# EAGLE design okinesio_v02 (EAGLE 7.5.0)
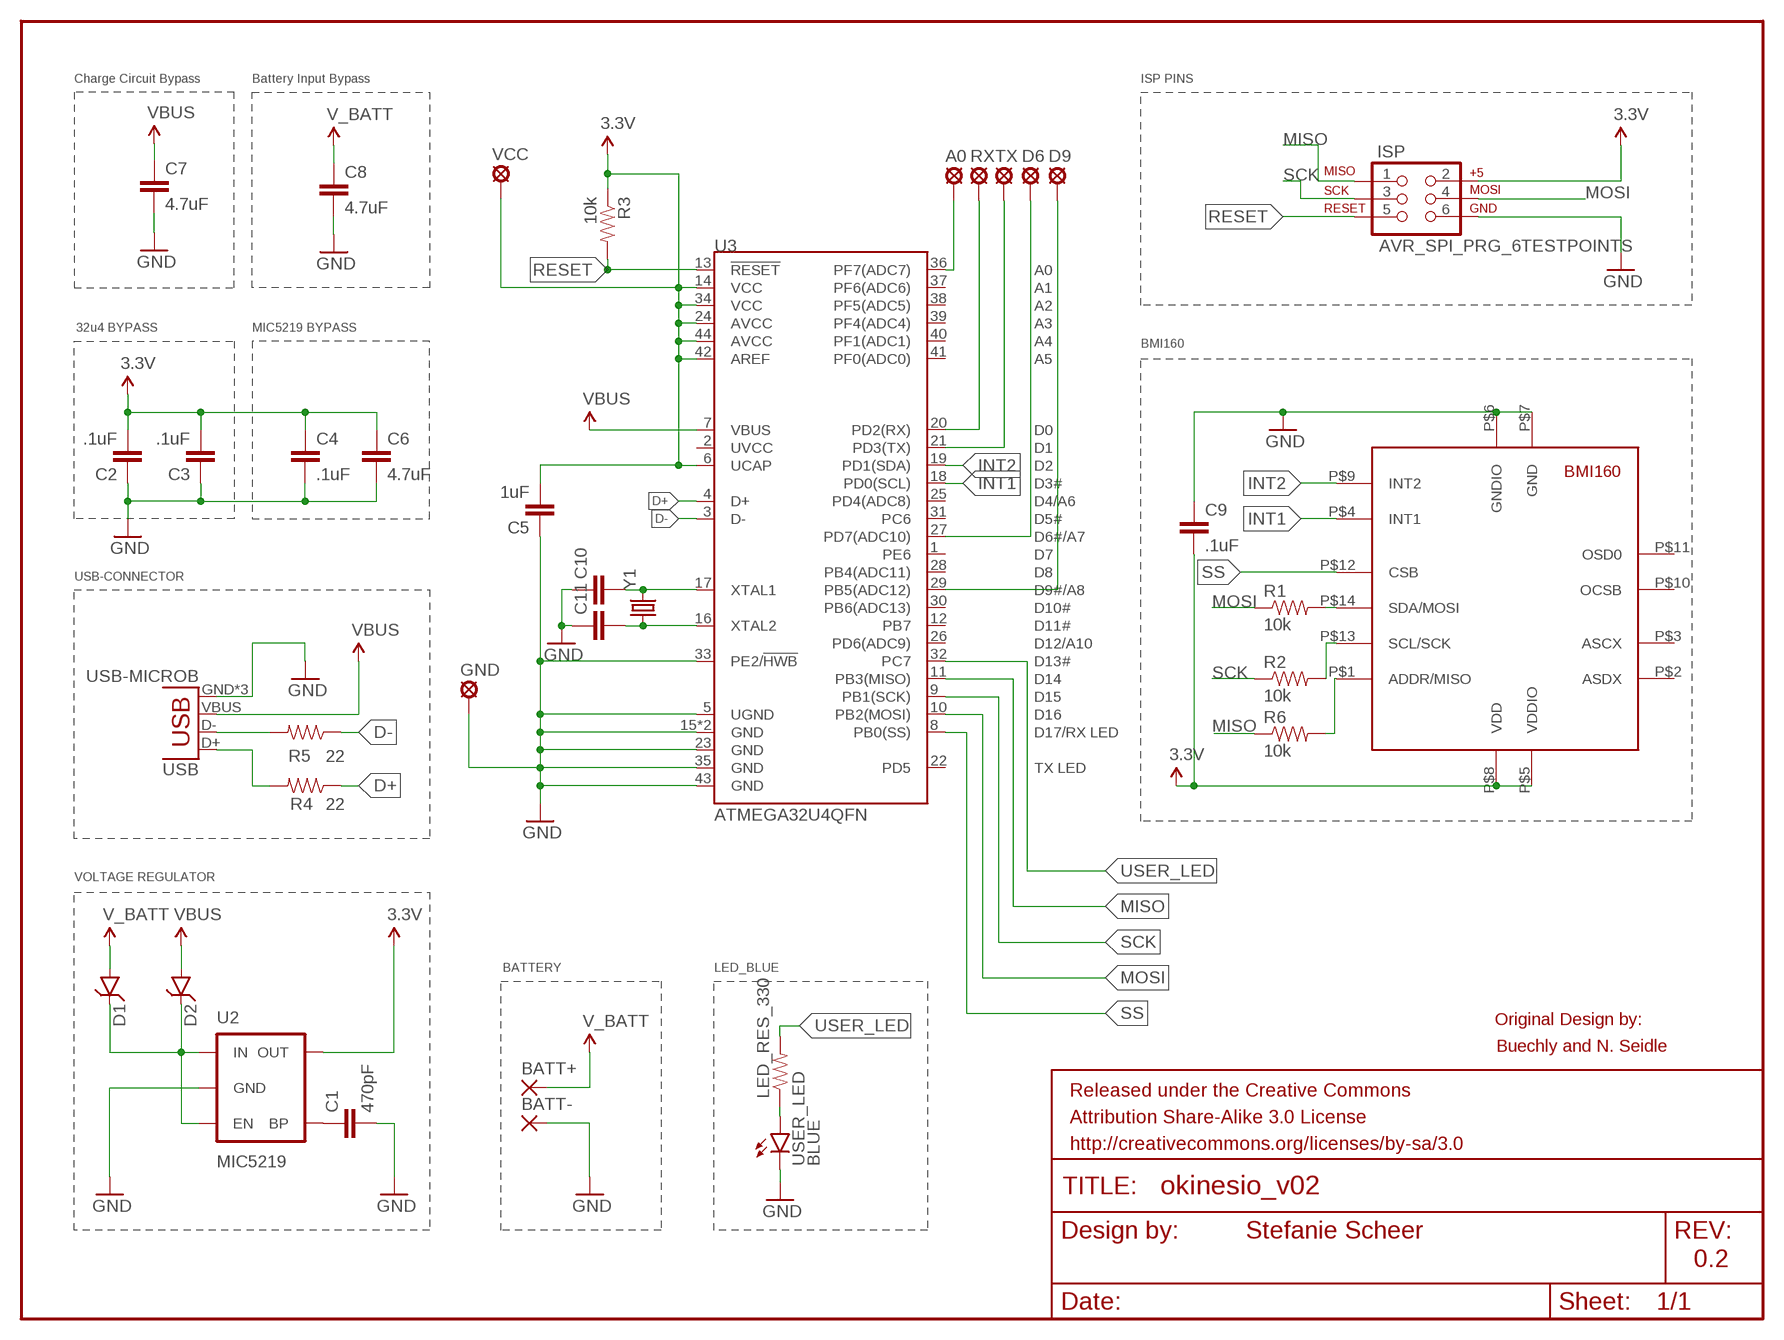
[diagram p0: schematic, sheet 1]

## Parts
A0  LSP10  [LSP10]
BATT+  SMD2  [SMD1,27-2,54]
BATT-  SMD2  [SMD1,27-2,54]
C1  470pF  CAP0603-CAP  [0603-CAP]
C2  .1uF  CAP0603-CAP  [0603-CAP]
C3  .1uF  CAP0603-CAP  [0603-CAP]
C4  .1uF  CAP0603-CAP  [0603-CAP]
C5  1uF  CAP0603-CAP  [0603-CAP]
C6  4.7uF  CAP0603-CAP  [0603-CAP]
C7  4.7uF  CAP0805  [0805]
C8  4.7uF  CAP0805  [0805]
C9  .1uF  CAP0603-CAP  [0603-CAP]
C10  CAP0603-CAP  [0603-CAP]
C11  CAP0603-CAP  [0603-CAP]
D1  DIODESOD123  [SOD-123]
D2  DIODESOD123  [SOD-123]
D6  LSP10  [LSP10]
D9  LSP10  [LSP10]
GND  LSP10  [LSP10]
ISP  AVR_SPI_PRG_6TESTPOINTS  [2X3_TEST_POINTS]
LED_RES_330  RESISTOR0603  [0603-RES]
R1  10k  RESISTOR0603-RES  [0603-RES]
R2  10k  RESISTOR0603-RES  [0603-RES]
R3  10k  RESISTOR0603-RES  [0603-RES]
R4  22  RESISTOR0603-RES  [0603-RES]
R5  22  RESISTOR0603-RES  [0603-RES]
R6  10k  RESISTOR0603-RES  [0603-RES]
RX  LSP10  [LSP10]
TX  LSP10  [LSP10]
U2  MIC5219  V_REG_MIC5219SMD  [SOT23-5]
U3  ATMEGA32U4QFN  [QFN-44]
U$3  BMI160LGA14  [LGA14-BMI160]
USB  USB-MICROB  [USB-MICROB]
USER_LED  BLUE  LED-BLUE0603  [LED-0603]
VCC  LSP10  [LSP10]
Y1  CRYSTALTXC-7A  [CRYSTAL-TXC-7A]

## Nets
3.3V: C2.2 C3.2 C4.1 C5.2 C6.1 C9.2 ISP.2 R3.1 U2.5(OUT) U3.6(UCAP) U3.14(VCC) U3.24(AVCC) U3.34(VCC) U3.42(AREF) U3.44(AVCC) U$3.P$5(VDDIO) U$3.P$8(VDD) VCC.MP
5V: C7.1 D2.A U3.7(VBUS) USB.VBUS ; supply symbol labelled VBUS
D+: R4.1 U3.4(D+)
D-: R5.1 U3.3(D-)
GND: BATT-.1(P) C1.2 C2.1 C3.1 C4.2 C5.1 C6.2 C7.2 C8.2 C9.1 C10.1 C11.1 GND.MP ISP.6 U2.2(GND) U3.5(UGND) U3.15(GND) U3.23(GND) U3.33(PE2/!HWB) U3.35(GND) U3.43(GND) U3.EPAD(GND) U$3.P$6(GNDIO) U$3.P$7(GND) USB.GND USB.MT1(GND) USB.MT2(GND) USER_LED.C
INT1: U3.18(PD0(SCL)) U$3.P$4(INT1)
INT2: U3.19(PD1(SDA)) U$3.P$9(INT2)
MISO: ISP.1 R6.1 U3.11(PB3(MISO))
MOSI: ISP.4 R1.1 U3.10(PB2(MOSI))
N$1: D1.C D2.C U2.1(IN) U2.3(EN)
N$2: D6.MP U3.27(PD7(ADC10))
N$3: TX.MP U3.21(PD3(TX))
N$4: A0.MP U3.36(PF7(ADC7))
N$5: C10.2 U3.17(XTAL1) Y1.P$2
N$6: D9.MP U3.29(PB5(ADC12))
N$7: LED_RES_330.1 USER_LED.A
N$8: C1.1 U2.4(BP)
N$9: RX.MP U3.20(PD2(RX))
N$12: R1.2 U$3.P$14(SDA/MOSI)
N$13: R5.2 USB.D-
N$14: R4.2 USB.D+
N$15: R2.2 U$3.P$13(SCL/SCK)
N$16: R6.2 U$3.P$1(ADDR/MISO)
N$18: C11.2 U3.16(XTAL2) Y1.P$1
RESET: ISP.5 R3.2 U3.13(!RESET)
SCK: ISP.3 R2.1 U3.9(PB1(SCK))
SS: U3.8(PB0(SS)) U$3.P$12(CSB)
USER_LED: LED_RES_330.2 U3.32(PC7)
V_BATT: BATT+.1(P) C8.1 D1.A
Unconnected: U3.1(PE6) U3.2(UVCC) U3.12(PB7) U3.22(PD5) U3.25(PD4(ADC8)) U3.26(PD6(ADC9)) U3.28(PB4(ADC11)) U3.30(PB6(ADC13)) U3.31(PC6) U3.37(PF6(ADC6)) U3.38(PF5(ADC5)) U3.39(PF4(ADC4)) U3.40(PF1(ADC1)) U3.41(PF0(ADC0)) U$3.P$2(ASDX) U$3.P$3(ASCX) U$3.P$10(OCSB) U$3.P$11(OSD0)

## Notes on the sheet
- Charge Circuit Bypass | Battery Input Bypass | ISP PINS
- 32u4 BYPASS | MIC5219 BYPASS
- BMI160
- USB-CONNECTOR
- VOLTAGE REGULATOR
- BATTERY | LED_BLUE
- Original Design by:
- Buechly and N. Seidle
- Stefanie Scheer
- 0.2

## Library data of the parts
A0 D6 D9 GND RX TX VCC = solpad:LSP10: SOLDER PAD drill 1.0 mm, distributor Buerklin, 12H555
BATT+ BATT- = wirepad_3x2:SMD2: SMD PAD
C1 = SparkFun-Passives:CAP: Capacitor Standard 0603 ceramic capacitor, and 0.1" leaded capacitor.; PROD_ID: CAP-07884
C2 C9 = SparkFun-Passives:CAP: Capacitor Standard 0603 ceramic capacitor, and 0.1" leaded capacitor.; PROD_ID: CAP-00810
C3 = SparkFun-Passives:CAP: Capacitor Standard 0603 ceramic capacitor, and 0.1" leaded capacitor.; PROD_ID: CAP-08280
C4 C6-C8 C10 C11 = SparkFun-Capacitors:CAP: Capacitor Standard 0603 ceramic capacitor, and 0.1" leaded capacitor.
C5 = SparkFun-Passives:CAP: Capacitor Standard 0603 ceramic capacitor, and 0.1" leaded capacitor.; PROD_ID: CAP-00868
D1 D2 = SparkFun-DiscreteSemi_angepasst:DIODE: Diode These are standard reverse protection diodes and small signal diodes. SMA package can handle up to about 1A. SOD-323 can handle about 200mA. What the SOD-323 package when ordering, there are some mfgs out there that are 5-pin packages.
ISP = SparkFun-Connectors_usb_neu_2:AVR_SPI_PRG_6: AVR ISP 6 Pin This is the reduced ISP connector for AVR programming. Common on Arduino. This footprint will take up less PCB space and can be used with a 10-pin to 6-pin adapter such as SKU: BOB-08508 **Special note about "TEST_POINT" package. The stop mask is on the top side, so if you want your programming test points to be on the bottom of your board, make sure to place this package on the bottom side of the board. This also ensure that the orientation to program from the bottom side will be correct.
LED_RES_330 = SparkFun-Resistors:RESISTOR: Resistor Basic schematic elements and footprints for 0603, 1206, and PTH resistors.
R1-R3 R6 = SparkFun-Passives:RESISTOR: Resistor Basic schematic elements and footprints for 0603, 1206, and PTH resistors.; PROD_ID: RES-00824
R4 R5 = SparkFun-Passives:RESISTOR: Resistor Basic schematic elements and footprints for 0603, 1206, and PTH resistors.; PROD_ID: RES-08698
U2 = SparkFun-PowerIC:V_REG_MIC5219: V_REG MIC5219 Standard 500mA LDO voltage regulator in SOT-23 layout. Micrel part MIC5219. BP (by-pass) pin is used to lower output noise with 470pF cap, may be left open.; PROD_ID: VREG-09872
U3 = SparkFun-DigitalIC:ATMEGA32U4: Atmel 44-pin 8-bit Microcontroller with 32KBytes of ISP Flash and USB Controller; PROD_ID: IC-10828
U$3 = User-Submitted:BMI160: BMI160 Internal Measurement Unit
USB = SparkFun-Connectors_usb_neu_2:USB: USB Connectors USB-B-PTH is fully proven SKU : PRT-00139/CONN-08278 USB-miniB is fully proven SKU : PRT-00587 USB-A-PCB is untested. USB-A-H is throughly reviewed, but untested. Spark Fun Electronics SKU : PRT-00437 USB-B-SMT is throughly reviewed, but untested. Needs silkscreen touching up. USB-A-S has not been used/tested USB-MB-H has not been used/tested USB-MICROB has been used. CONN-09505; PROD_ID: CONN-09505
USER_LED = SparkFun-LED:LED-BLUE: Blue LEDs for production use Various blue LEDs stocked by SparkFun production 0603 - DIO-08575 Rebel - DIO-09553 1206 - DIO-09911; PROD_ID: DIO-08575
Y1 = SparkFun-FreqCtrl:CRYSTAL: Various standard crystals. Proven footprints.

## Board
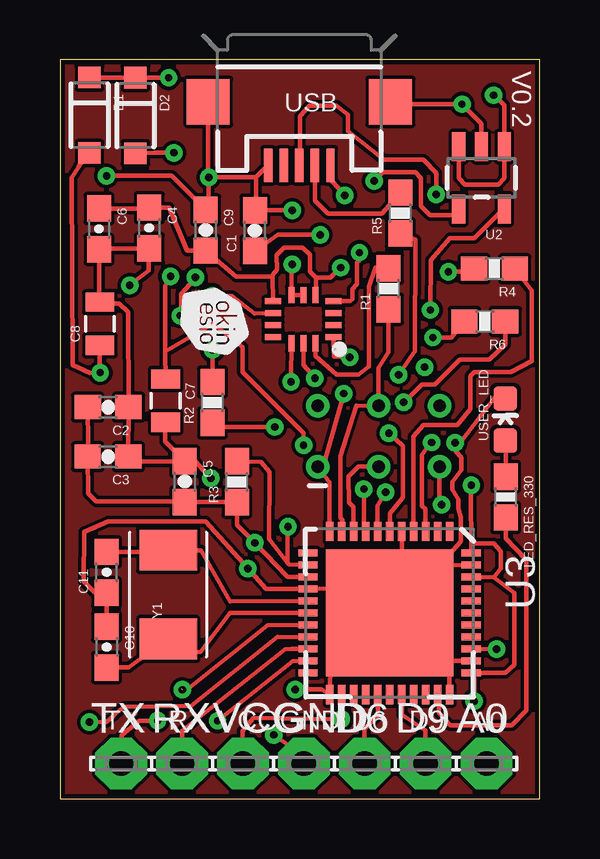
[diagram p1: board, top side]
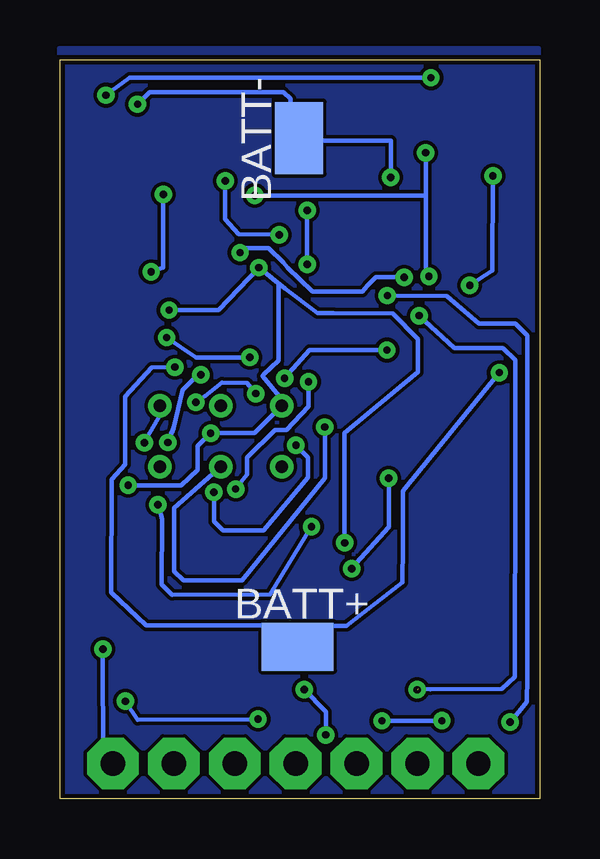
[diagram p2: board, bottom side, seen from below]

Size 20 x 30.8 mm. Coordinates in mm from the lower left corner, seen from the top.
Outline: 0,0 20,0 20,30.8 0,30.8 0,0
Copper layers (1*16): Top 0.035mm / dielectric 1.5mm / Bottom 0.035mm
Design rules "Eagle-DRU LochLP GmbH - 01 and 02 layers - 35mue *": minimum track width 0.15mm, minimum drill 0.3mm, track to track 0.15mm, track to pad 0.15mm, pad to pad 0.15mm, via to via 0.15mm, smd to smd 0.15mm, copper to edge 0.2mm, drill to drill 0.25mm, minimum pad ring 0.23mm, minimum via ring 0.21mm, stop-mask expansion 0.05mm, vias tented up to drill 12mil, thermal gap 0.2mm

### Footprints (pad centres in the part's own frame; a part is rotated, then mirrored left to right if it is on the bottom)
LSP10 = drill 1.016 pad 2.159 octagon: MP 0,0
SMD1,27-2,54 = smd 1.27 x 2.54: 1 0,0 | smd 2 x 3: P$1 0.362,0.235
0603-CAP = smd 1.1 x 1: 1 -0.85,0; 2 0.85,0
0805 = smd 0.8 x 1.2: 1 -0.9,0; 2 0.9,0
SOD-123 = smd 0.9 x 0.95: A 1.575,0; C -1.575,0
2X3_TEST_POINTS = drill 0.508: 1 -2.54,-1.27; 2 -2.54,1.27; 3 0,-1.27; 4 0,1.27; 5 2.54,-1.27; 6 2.54,1.27
0603-RES = smd 1.1 x 1: 1 -0.85,0; 2 0.85,0
SOT23-5 = smd 0.55 x 1.2: 1 -0.95,-1.3; 2 0,-1.3; 3 0.95,-1.3; 4 0.95,1.3; 5 -0.95,1.3
QFN-44 = smd 0.8 x 0.3: 1 -3.4,2.5; 2 -3.4,2; 3 -3.4,1.5; 4 -3.4,1; 5 -3.4,0.5; 6 -3.4,0; 7 -3.4,-0.5; 8 -3.4,-1; 9 -3.4,-1.5; 10 -3.4,-2; 11 -3.4,-2.5; 23 3.4,-2.5; 24 3.4,-2; 25 3.4,-1.5; 26 3.4,-1; 27 3.4,-0.5; 28 3.4,0; 29 3.4,0.5; 30 3.4,1; 31 3.4,1.5; 32 3.4,2; 33 3.4,2.5 | smd 0.3 x 0.8: 12 -2.5,-3.4; 13 -2,-3.4; 14 -1.5,-3.4; 15 -1,-3.4; 16 -0.5,-3.4; 17 0,-3.4; 18 0.5,-3.4; 19 1,-3.4; 20 1.5,-3.4; 21 2,-3.4; 22 2.5,-3.4; 34 2.5,3.4; 35 2,3.4; 36 1.5,3.4; 37 1,3.4; 38 0.5,3.4; 39 0,3.4; 40 -0.5,3.4; 41 -1,3.4; 42 -1.5,3.4; 43 -2,3.4; 44 -2.5,3.4 | smd 5.3 x 5.3: EPAD 0,0
LGA14-BMI160 = smd 0.675 x 0.25: P$1 -1.262,0.75; P$2 -1.262,0.25; P$3 -1.262,-0.25; P$4 -1.262,-0.75; P$8 1.262,-0.75; P$9 1.262,-0.25; P$10 1.262,0.25; P$11 1.262,0.75 | smd 0.25 x 0.675: P$5 -0.5,-1.012; P$6 0,-1.012; P$7 0.5,-1.012; P$12 0.5,1; P$13 0,1; P$14 -0.5,1
USB-MICROB = smd 0.35 x 1.4: D+ 0,2.65; D- -0.65,2.65; GND 1.3,2.65; ID 0.65,2.65; VBUS -1.3,2.65 | smd 1.8 x 1.9: MT1 -3.8,0; MT2 3.8,0
LED-0603 = smd 1 x 1: A 0,-0.877; C 0,0.877
CRYSTAL-TXC-7A = smd 1.7 x 2.4: P$1 1.85,0; P$2 -1.85,0

### Placement (x,y rotation side)
A0  17.79,1.47 0 top
BATT+  10.32,6.7 270 bottom
BATT-  10.38,27.3 0 bottom
C1  8.13,23.69 90 top
C2  2.01,16.32 180 top
C3  2.01,14.27 180 top
C4  3.73,23.79 270 top
C5  5.21,13.22 270 top
C6  1.63,23.75 270 top
C7  4.41,16.6 270 top
C8  1.67,19.8 90 top
C9  6.07,23.7 270 top
C10  1.95,6.32 270 top
C11  1.95,9.44 90 top
D1  1.23,28.49 270 top
D2  3.14,28.48 270 top
D6  12.71,1.47 0 top
D9  15.25,1.47 0 top
GND  10.17,1.47 0 top
ISP  13.29,15.11 0 top
LED_RES_330  18.59,12.58 270 top
R1  13.71,21.26 90 top
R2  6.35,16.52 90 top
R3  7.38,13.21 90 top
R4  18.12,22.1 180 top
R5  14.19,24.42 90 top
R6  17.72,19.9 180 top
RX  5.09,1.47 0 top
TX  2.55,1.47 0 top
U2  17.58,25.88 180 top
U3  13.75,7.74 270 top
U$3  10.15,19.99 180 top
USB  9.98,29.06 180 top
USER_LED  18.57,15.81 0 top
VCC  7.63,1.47 0 top
Y1  4.51,8.51 90 top

### Tracks (layer width: path | path; a pad name or v marks a point on that pad's centre or on a via)
3.3V  (via drill 0.3)
  Top 0.178: 18.08,9.23 18.38,9.6 18.38,10.3 18.1,10.65 17.18,10.65 U3.44 17.14,12.87 v17.16,13.07 | 18.08,9.23 U3.42 | 18.08,9.23 18.95,8.59 18.95,5.57 18.57,5.24 U3.34 17.27,5.03 v17.27,4.06 | U$3.P$8 8.86,21.77 | 10.67,21.73 10.67,21.02 U$3.P$5 | U2.5 18.49,24.58 17.27,23.37 16.26,23.37 15.47,22.46 v15.45,20.37 | v11.7,22.14 11.29,21.72 10.67,21.73 | 1.15,15.98 C2.2 1.17,14.79 C3.2 1.17,12.73 1.51,12.4 5.01,12.4 C5.2 R3.1 7.38,11.42 v8.13,10.67 9.47,9.28 | 8.86,21.77 7.34,21.77 C9.2 5.3,22.86 4.56,24.65 C4.1 3.61,24.61 C6.1 | 9.47,9.28 10.41,9.21 U3.14 9.51,9.26 9.47,9.28 | VCC.MP 7.62,2.84 8.08,3.37 v11.74,3.32 | v11.74,3.32 11.75,4.06 11.75,4.66 U3.24 11.77,4.14 v11.74,3.32 | U3.6 13.77,11.88 14.29,12.55 14.3,14.7 v13.72,15.24 | 8.86,21.77 8.86,21.82 9.05,22.06 9.03,22.66 9.34,22.98 10.12,22.98 10.42,22.68 10.42,21.97 10.67,21.73
  Bottom 0.178: v15.45,20.37 13.39,20.37 v11.7,22.14 | v11.7,22.14 10.89,21.47 10.88,18.27 11.52,17.69 11.56,17.63 10.75,16.66 ISP.2 11.89,15.24 v13.72,15.24 14.26,14.7 14.26,13.72 14.94,13.07 v17.16,13.07 | v11.74,3.32 16.77,3.29 v17.27,4.06 | v8.13,10.67 8.13,15.24 5.08,17.78 5.08,19.16 6.11,20.23 8.59,20.24 9.27,20.24 10.62,21.28 v11.7,22.14
5V  (via drill 0.3)
  Top 0.178: U3.7 13.25,12.21 v13.58,12.79 | D2.A 3.94,26.93 v4.75,26.93 | USB.VBUS 11.28,25.8 11.68,25.4 11.69,25.4 v11.87,25.15 | v4.62,21.78 4.38,21.37 4.38,20.37 4.39,20.36 4.38,18.6 C7.1 4.38,18.65 6.39,19.8 7.62,18.84 7.62,17.78 10.16,15.24 v10.16,14.73
  Bottom 0.178: v13.58,12.79 13.57,11.56 13.21,11.18 11.51,11.18 9.65,13.38 9.65,14.22 v10.16,14.73 | v11.87,25.15 9.45,25.14 4.75,25.15 | 4.75,25.15 v4.75,26.93 | 4.75,25.15 4.75,22.17 v4.62,21.78
D+
  Top 0.178: R4.1 19.67,21.19 19.68,20.71 19.68,20.48 19.68,18.24 18.8,17.78 17.27,17.78 17.11,17.62 17.11,17.34 17.11,16.26 16.57,15.57 15.16,15.57 14.73,15.09 14.73,11.57 U3.4
D-  (via drill 0.3 pad 0.25)
  Top 0.178: U3.3 15.23,11.57 15.24,11.58 15.24,12.07 15.09,12.21 15.09,14.34 15.39,14.74 v15.5,14.85 | v14.12,17.68 14.22,17.81 14.8,18.67 14.83,23.32 R5.1
  Bottom 0.178: v15.5,14.85 15.26,15.45 14.88,17.04 14.4,17.52 v14.12,17.68
GND  (via drill 0.3, 0.3 pad 0.25, 0.3 pad 0.3)
  Top 0.178: U3.5 14.28,9.82 | 14.28,9.82 14.28,8.09 U3.EPAD 13.77,6.14 11.28,6.14 11.28,5.25 U3.23 | 16.82,5.76 16.27,5.76 16.25,5.57 U3.33 | U3.35 13.84,5.75 | 13.73,8.8 U3.15 10.34,8.76 9.08,8.76 8.59,8.76 v7.84,9.59 6.08,11.55 2.01,11.55 1.01,11.12 0.99,9.07 1.46,8.61 C11.1 1.95,8.14 C10.1 | U3.43 16.23,9.74 | 14.28,9.82 16.25,10.19 16.72,10.73 16.72,11.72 16.61,12.11 16.61,12.48 16.36,12.89 16.36,13.21 16.74,13.72 16.74,14.22 16.48,14.51 v16.48,14.84 16.7,14.85 18.11,16.7 USER_LED.C | 11.27,4.68 U3.23 | 17.59,26.9 U2.2 17.57,28.14 v16.76,28.96 13.88,28.96 USB.MT1 | 6.17,29.04 USB.MT2 6.18,26 v6.2,25.91 | 8.69,26.34 8.69,26.4 USB.GND 8.19,25.91 | 8.19,25.91 v6.2,25.91 | 8.19,25.91 8.19,24.6 C1.2 9.12,24.53 v9.69,24.53 | v6.2,25.91 6.2,24.68 C9.1 4.65,25.97 v1.94,25.97 | 5.24,14.1 C5.1 | C5.1 3.15,14.07 C3.1 C2.1 2.85,20.29 2.47,20.65 1.72,20.65 C8.2 1.63,20.74 C6.2 1.67,22.94 C4.2 3.7,22.01 v2.91,21.41 | C5.1 5.66,14.07 v6.29,13.36 | GND.MP 10.18,1.79 v8.91,2.66 | v9.81,4.56 10.9,4.56 U3.23 | U$3.P$6 U$3.P$7 9.65,21.84 v9.69,22.28 | C7.2 4.38,14.89 C5.1
  Top 0.254: U3.35 16.82,5.76 | 13.73,8.8 U3.EPAD | 16.23,9.74 16.25,10.19 | 13.77,6.14 13.84,5.75
  Bottom 0.178: v6.2,25.91 6.21,27.43 10.26,27.43 BATT-.1 10.38,29.18 10.67,29.46 16.26,29.46 v16.76,28.96 | v6.29,13.36 6.27,11.34 v7.84,9.59 | ISP.6 15.83,16 v16.48,14.84 | v8.91,2.66 8.9,3.62 v9.81,4.56 | v9.69,22.28 v9.69,24.53 | v1.94,25.97 1.97,22.01 v2.91,21.41
INT1  (via drill 0.3)  (1 unrouted)
  Top 0.178: U$3.P$4 12.1,20.74 12.19,20.83 12.19,21.25 12.38,21.46 12.38,22.36 12.49,22.44 v12.49,22.77 | v5.64,21.74 5.59,21.65 5.04,21.03 5.04,20.43 v5.03,20.14 | v5.1,4.54 5.36,4.61 8.66,7.23 10.25,7.25 U3.18
  Bottom 0.178: 5.08,4.57 4.55,4.57 1.56,4.59 1.02,5.09 1.02,13.72 1.02,18.29 1.52,18.8 3.56,18.8 v5.03,20.14 | v12.49,22.77 12.46,22.77 12.28,22.95 11.31,22.95 10.67,22.35 10.52,22.15 9.46,21.14 8.79,21.14 8.15,21.14 7.38,21.14 7.17,21.38 6.83,21.75 6.35,21.75 5.66,21.75 v5.64,21.74
INT2  (via drill 0.3)
  Top 0.178: U$3.P$9 8.12,20.22 7.18,20.96 6.48,20.96 v6.35,20.98 | v1.23,3.19 1.96,3.22 2.23,3.45 2.33,3.56 2.67,3.84 5.48,3.88 9.08,6.74 10.33,6.72 U3.19
  Bottom 0.178: v6.35,20.98 3.87,20.96 2.54,19.81 1.02,19.81 0.51,19.3 0.51,5.08 0.53,4.04 v1.23,3.19
MISO  (via drill 0.3)
  Top 0.178: 11.22,11.49 U3.11 11.25,13.19 ISP.1 11.03,14.05 v11.84,16.89 | R6.1 18.57,18.94 17.91,18.31 16.67,18.31 15.63,17.27 15.09,17.27 v14.34,16.52
  Bottom 0.178: v14.34,16.52 13.94,16.8 13.25,17.35 12.19,17.33 v11.84,16.89
MOSI
  Top 0.178: U3.10 11.77,11.62 11.69,11.71 11.7,14.28 12.37,16.38 ISP.4 13.28,17.78 13.28,17.95 13.71,18.63 R1.1
N$1  (via drill 0.3)
  Top 0.178: 16.62,26.89 U2.3 | U2.3 16.62,25.87 16.89,25.61 18.27,25.61 18.53,25.86 18.53,26.88 U2.1 18.53,28.91 18.11,29.33 v18.09,29.33 | 16.62,26.89 U2.3 | D1.C D2.C 3.68,30.06 v4.53,30.06
  Top 0.254: U2.1 18.52,26.89
  Bottom 0.178: v4.53,30.06 17.09,30.06 v18.09,29.33
N$2
  Top 0.178: D6.MP 12.7,2.91 13.25,3.46 13.26,3.7 U3.27
N$3  (via drill 0.3 pad 0.25)
  Top 0.178: TX.MP 2.54,1.51 2.56,2.64 3.3,3.25 v4.07,3.25 | U3.21 9.7,5.72 v6.57,3.25
  Bottom 0.178: v6.57,3.25 v4.07,3.25
N$4  (via drill 0.3 pad 0.25)
  Top 0.178: v18.21,6.24 17.16,6.23
  Top 0.254: 17.16,6.23 U3.36
  Bottom 0.178: v18.21,6.24 18.21,1.47 A0.MP
N$5
  Top 0.178: U3.17 10.11,7.76 7.09,7.75 5.86,6.13 5.61,6.1 Y1.P$2 2.85,5.47 C10.2
N$6
  Top 0.178: D9.MP 15.25,1.51 15.25,2.85 14.26,3.49 U3.29
N$7
  Top 0.178: LED_RES_330.1 18.59,14.93
  Top 0.254: 18.59,14.93 USER_LED.A
N$8  (via drill 0.3)
  Top 0.178: U2.4 16.62,24.34 15.43,24.34 15.06,24.7 15.06,25.88 14.82,26.12 13.46,26.12 v13.1,25.76 | v10.85,23.51 9.1,23.51 C1.1
  Top 0.254: U2.4 16.64,24.51
  Bottom 0.178: v13.1,25.76 13.1,24.16 12.56,23.53 v10.85,23.51
N$9
  Top 0.178: U3.20 9.65,6.25 9.39,6.23 5.1,2.84 RX.MP
N$10
  pour Top: 0,30.83 20.05,30.83 20.01,0.01 -0.04,0.01
N$12
  Top 0.178: 10.67,18.97 U$3.P$14 10.65,18.76 10.66,18.45 11.54,17.68 12.45,17.69 12.88,18.02 12.88,21.34 13.16,22.14 R1.2
N$13
  Top 0.178: USB.D- 10.63,24.93 11.18,24.38 13.42,24.38 R5.2
N$14  (via drill 0.3 pad 0.25)
  Top 0.178: v15.69,25.19 15.69,26.08 15.15,26.64 13.51,26.64 12.01,27.84 12.01,28.51 11.54,28.88 10.4,28.88 10.01,28.46 10.01,26.43 USB.D+ | v16.2,21.97 16.92,21.97 R4.2
  Bottom 0.178: v15.69,25.19 15.69,22.15 v16.2,21.97
N$15  (via drill 0.3)
  Top 0.178: U$3.P$13 10.15,18.09 v10.63,17.54 | R2.2 6.36,18.03 v6.37,18.71
  Bottom 0.178: v10.64,17.53 v10.63,17.54 9.59,18.71 v6.37,18.71
N$16  (via drill 0.3)
  Top 0.178: U$3.P$1 11.43,18.43 v12.09,18.4 | v15.55,19.23 16.32,19.22 R6.2
  Bottom 0.178: v12.09,18.4 14.33,18.39 v15.55,19.23
N$17
  pour Bottom: 0.03,31.3 20.02,31.3 20,0.01 0,0.01
N$18
  Top 0.178: C11.2 3.37,10.29 Y1.P$1 5.18,10.36 5.88,10.36 7.1,8.23 U3.16
RESET  (via drill 0.3 pad 0.25)
  Top 0.178: R3.2 8.39,14.04 8.74,13.62 8.72,10.84 9.5,9.83 | 9.5,9.83 9.54,9.77 10.38,9.75 U3.13 | ISP.5 15.83,12.52 v15.91,12.26 | v9.51,11.34 9.49,10.93 9.5,10.72 9.5,9.83
  Bottom 0.178: v9.51,11.34 11.24,8.52 15.32,8.5 15.75,8.94 15.75,11.66 v15.91,12.26
SCK  (via drill 0.3)
  Top 0.178: ISP.3 13.02,13.86 12.46,13.85 12.03,13.43 12.05,12.35 12.25,12.16 U3.9 | v8.95,15.5 6.53,15.5 R2.1
  Bottom 0.178: v8.95,15.5 8.95,13.38 12.4,9.11 14.83,9.11 15.24,9.48 15.24,12.13 ISP.3
SS  (via drill 0.3 pad 0.25)
  Top 0.178: U3.8 12.67,11.59 v12.67,12.91 | v9.64,17.38 9.63,17.53 U$3.P$12
  Bottom 0.178: v12.67,12.91 12.19,13.51 12.19,14.22 11.04,15.38 10.55,15.38 9.64,16.34 v9.64,17.38
USER_LED
  Top 0.178: LED_RES_330.2 18.59,10.85 19.44,9.98 19.46,9.96 19.46,3.67 18.84,3.06 16.28,3.05 15.8,3.57 15.81,4.23
  Top 0.254: 15.81,4.23 U3.32
V_BATT  (via drill 0.3 pad 0.25)
  Top 0.178: D1.A 0.79,26.36 0.81,26.38 0.48,25.9 0.52,18.08 1.26,17.76 v1.68,17.77 1.67,18.02 C8.1
  Bottom 0.178: v1.68,17.77 5.7,12.84 5.7,11.85 5.7,11.08 5.71,10.57 5.73,9.03 8.05,7.2 9.08,7.2 8.98,7.23 9.29,7.25 BATT+.1 10.55,7.22 12.48,7.22 13.99,7.24 16.41,7.22 17.86,8.6 17.85,13.31 17.27,13.93 17.27,16.76 16.17,17.98 v15.2,17.99

### Text on the board
tPlace: V0.2 | TX | RX | VCC | GND | D6 | D9 | A0